# Altium schematic sheet USD_PD.SchDoc
size Letter; SheetNumber: 13; SheetTotal: 15
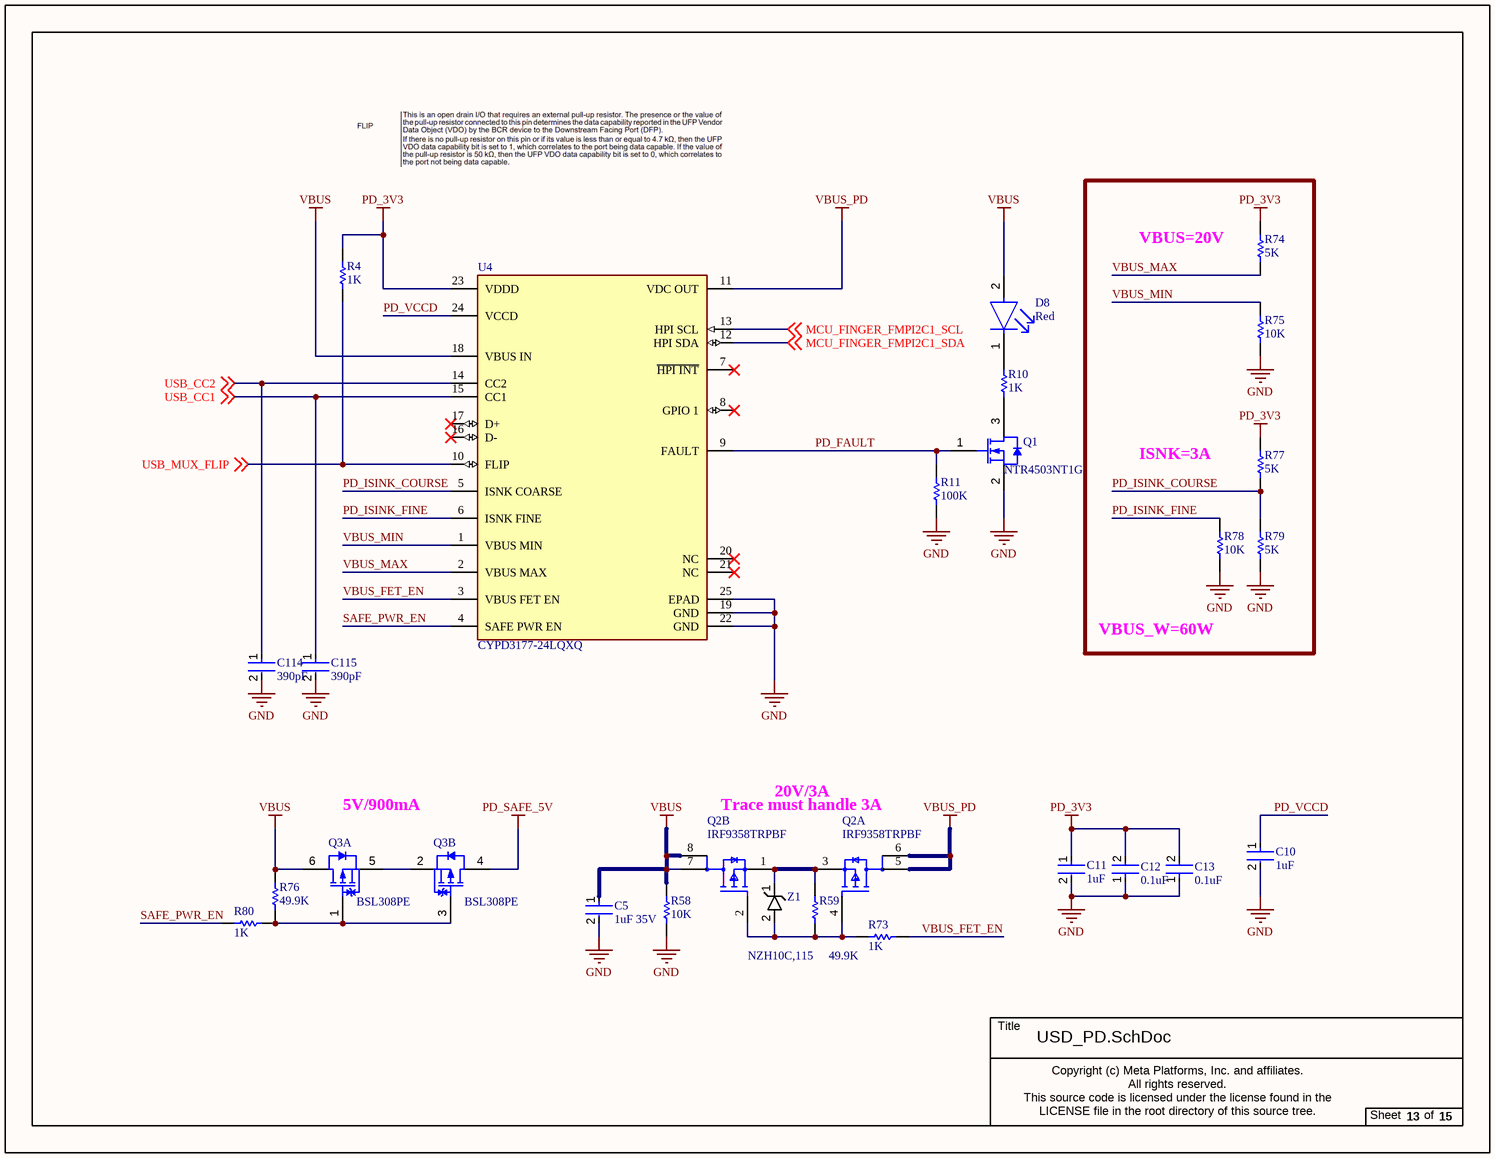
[diagram p0: USD_PD.SchDoc]

## Parts
C5  1uF 35V  [FP-C1005-050-0_05-IPC_C]
C10  1uF  [FP-CL511-IPC_C]
C11  1uF  [FP-CL511-IPC_C]
C12  0.1uF  [FP-CC0201-BA-MFG]
C13  0.1uF  [FP-CC0201-BA-MFG]
C114  390pF  [FP-C0402-BB-MFG]
C115  390pF  [FP-C0402-BB-MFG]
D8  Red  [FP-LTST-C190KRKT-MFG]
Q1  NTR4503NT1G  [ONSC-SOT-23-3-318-08_V]
Q2  IRF9358TRPBF  [FP-PG-DSO-8-IPC_A]  (parts A,B of 2)
Q3  BSL308PE  [INF-PG-TSOP-6_N]  (parts A,B of 2)
R4  1K  [RESC1005X40X25NL05T05]
R10  1K  [RESC1005X40X25NL05T05]
R11  100K  [RESC1005X40X25NL05T10]
R58  10K  [RESC1005X40X25ML05T10]
R59  49.9K  [RESC1005X35X20LL05T10]
R73  1K  [RESC1005X40X25NL05T05]
R74  5K  [RESC1005X35X20LL05T10]
R75  10K  [RESC1005X40X25ML05T10]
R76  49.9K  [RESC1005X35X20LL05T10]
R77  5K  [RESC1005X35X20LL05T10]
R78  10K  [RESC1005X40X25ML05T10]
R79  5K  [RESC1005X35X20LL05T10]
R80  1K  [RESC1005X40X25NL05T05]
U4  CYPD3177-24LQXQ  [FP-002-16934-IPC_C]
Z1  NZH10C,115  [SODFL3516X120N]

## Nets
GND: C5.2 C10.2 C11.2 C12.1 C13.1 C114.2 C115.2 Q1.2(S) R11.1 R58.1 R75.2 R78.2 R79.1 U4.19(GND) U4.22(GND) U4.25(EPAD)
PD_3V3: C11.1 C12.2 C13.2 R4.1 R74.2 R77.2 U4.23(VDDD)
PD_SAFE_5V: Q3.4(DRAIN)
VBUS: C5.1 D8.2(A) Q2.7(D2) Q2.8(D2) Q3.6(DRAIN) R58.2 R76.2 U4.18(VBUS_IN)
VBUS_PD: Q2.5(D1) Q2.6(D1) U4.11(VDC_OUT)
MCU_FINGER_FMPI2C1_SCL: U4.13(HPI_SCL) ; off-sheet MCU_FINGER_FMPI2C1_SCL
MCU_FINGER_FMPI2C1_SDA: U4.12(HPI_SDA) ; off-sheet MCU_FINGER_FMPI2C1_SDA
PD_FAULT: Q1.1(G) R11.2 U4.9(FAULT)
PD_ISINK_COURSE: R77.1 R79.2 U4.5(ISNK_COARSE)
PD_ISINK_FINE: R78.1 U4.6(ISNK_FINE)
PD_VCCD: C10.1 U4.24(VCCD)
SAFE_PWR_EN: R80.2 U4.4(SAFE_PWR_EN)
USB_CC1: C115.1 U4.15(CC1) ; off-sheet USB_CC1
USB_CC2: C114.1 U4.14(CC2) ; off-sheet USB_CC2
USB_MUX_FLIP: R4.2 U4.10(FLIP) ; off-sheet USB_MUX_FLIP
VBUS_FET_EN: R73.1 U4.3(VBUS_FET_EN)
VBUS_MAX: R74.1 U4.2(VBUS_MAX)
VBUS_MIN: R75.1 U4.1(VBUS_MIN)
NetD8_1: D8.1(C) R10.2
NetQ1_3: Q1.3(D) R10.1
NetQ2_1: Q2.1(S2) Q2.3(S1) R59.2 Z1.1(K)
NetQ2_2: Q2.2(G2) Q2.4(G1) R59.1 R73.2 Z1.2(A)
NetQ3_1: Q3.1(GATE) Q3.3(GATE) R76.1 R80.1
NetQ3_2: Q3.2(SOURCE) Q3.5(SOURCE)

Not connected (* = marked no-connect by the designer): U4 7(~{HPI_INT})* 8(GPIO_1)* 16(D-)* 17(D+)* 20(NC)* 21(NC)*

## Notes on the sheet
- (near R74) VBUS=20V
- ISNK=3A
- VBUS_W=60W
- 5V/900mA
- (near Q2) Trace must handle 3A
- 20V/3A
- Title
- Copyright (c) Meta Platforms, Inc. and affiliates.
  All rights reserved.
  This source code is licensed under the license found in the
  LICENSE file in the root directory of this source tree.
- Sheet
- of

## Library data of the parts
C5 = CMP-2000-06004-2: Multilayer Ceramic Capacitors 1μF ±10% 35V X5R SMD 0402; Series: C; Voltage Rating (DC): 35V; Capacitance: 1uF; Max Operating Temperature: 85°C; Resistor Type: Ceramic; REACH SVHC: No SVHC; Package Quantity: 1; Packaging: Tape and Reel; Termination: SMD/SMT; Dielectric Material: Ceramic; Height: 0.5mm; Length: 1mm; Min Operating Temperature: -55°C; Dielectric: X5R; Thickness: 0.022inch; Lead Free: Lead Free; Voltage Rating: 35V; Width: 0.02inch; Depth: 0.5mm; Case Code (Imperial): 0402; Case/Package: 0402; Tolerance: 10%; Weight: 2.3E-05oz; Radiation Hardening: No; RoHS Compliant: Yes; Case Code (Metric): 1005; Mount: Surface Mount
C10 C11 = CMP-13271-001936-1: Cap Ceramic 1uF 10V X5R ±10% SMD 0402 +85°C Paper T/R; Depth: 0.5mm; Case Code (Imperial): 0402; Material: Ceramic; Mount: Surface Mount; Thickness: 0.022inch; Dielectric: X5R; Capacitance: 1uF; Radiation Hardening: No; Case/Package: 0402; Length: 1mm; Tolerance: 10%; Max Operating Temperature: 85°C; Package Quantity: 1; Width: 0.02inch; Voltage Rating: 10V; Contact Plating: Tin; Height: 0.5mm; Min Operating Temperature: -55°C; Case Code (Metric): 1005; Packaging: Tape and Reel
C12 C13 = CMP-03422-000376-1: CAP CER 0.1UF 6.3V X5R 0201; Manufacturer: Yageo; Manufacturer Part Number: CC0201KRX5R5BB104; Tolerance: 0.1; Temperature Coefficient: 15%; Value: 100 nF; Material: Ceramic; Automotive: No; Device Class L2: Capacitors; Temperature Range High: +85°C; Capacitance: 100 nF; Temperature: -55°C to +85°C; ComponentLink2URL: http://www.yageo.com/documents/recent/UPY-GPHC_X5R_4V-to-50V_25.pdf; Category: Cap; Mouser Description: Multilayer Ceramic Capacitors MLCC - SMD/SMT 100nF 6.3V X5R 10%; Ipc Land Pattern Name: CAPC6030X30; Temperature Characteristic: X5R; Voltage Rating: 6.3 V; Lead Free: Yes; Digikey Description: CAP CER 0.1UF 6.3V X5R 0201; Device Class L1: Passive Components; Octopart: https://octopart.com/cc0201krx5r5bb104-yageo-9292636; Height: 0.33mm; Package: CC0201-BA; Footprint Url: http://www.yageo.com/exep/pages/download/literatures/UPY-C_GEN_24.pdf; ComponentLink2Description: Datasheet; Device Class L3: Ceramic Capacitors; Temperature Range Low: -55°C; RoHS: TRUE
C114 C115 = CMP-2008-03313-2: CAP CER 390PF 50V C0G/NP0 0402; Manufacturer Part Number: C0402C391J5GACTU; Manufacturer: Kemet; Tolerance: 0.05; Temperature Coefficient: 15%; Material: Ceramic; Temperature Characteristic: C0G; Device Class L2: Capacitors; Value: 390 pF; Capacitance: 390 pF; Octopart: https://octopart.com/c0402c391j5gactu-kemet-13148117; ComponentLink2URL: https://content.kemet.com/datasheets/KEM_C1002_X7R_SMD.pdf; RoHS: TRUE; Temperature Range High: +125°C; ComponentLink2Description: Datasheet; Voltage Rating: 50 V; Ipc Land Pattern Name: CAPC10050X50; Package: C0402-BB; Lead Free: Yes; Digikey Description: CAP CER 390PF 50V C0G/NP0 0402; Category: Cap; Temperature: -55°C to +125°C; Device Class L3: Ceramic Capacitors; Device Class L1: Passive Components; Temperature Range Low: -55°C; Height: 0.55mm; Mouser Description: Multilayer Ceramic Capacitors MLCC - SMD/SMT 50volts 390pF 5% C0G; Automotive: No
D8 = CMP-1674-00011-2: LED RED CLEAR CHIP SMD; Reverse Voltage: 5V; Viewing Angle: 130°; Power Rating: 75mW; Test Current: 20mA; Number of Elements: 1; Lens Color: Colorless; Wavelength: 639nm; Dominant Wavelength: 631nm; Lens Style: Diffused; Forward Current: 30mA; Forward Voltage: 2.4V; Luminous Intensity: 54mcd; Color: Red; Case Code (Imperial): 0603; Lens Transparency: Clear; Lead Free: Lead Free; Package Quantity: 1; Packaging: Tape and Reel; Max Operating Temperature: 85°C; Number of Pins: 2; Height: 0.8mm; Case/Package: 0603; Number of LEDs: 1; Width: 0.8mm; Case Code (Metric): 1608; Depth: 0.8mm; Mount: Surface Mount; Radiation Hardening: No; Length: 1.6mm; Illumination Color: Red; Power Dissipation: 75mW; Min Operating Temperature: -55°C
Q1 = CMP-1058-00742-1: Power MOSFET, 30 V, 2.5 A, Single N-Channel, 3-Pin SOT-23, Pb-Free, Tape and Reel; Manufacturer: On Semiconductor; Qrr Typ (nC): 4; ID Max (A): 2.5; VGS(th) Max (V): 3; VGS Max (V): 20; Channel Polarity: N Channel; V(BR)DSS Min (V): 30; ComponentLink3URL: http://www.onsemi.cn/pub_link/Collateral/318-08.PDF; PackageReference: SOT-23-3-318-08; ComponentLink2URL: http://www.onsemi.cn/pub_link/Collateral/NTR4503N-D.PDF; ComponentLink2Description: Datasheet; ComponentLink1Description: Manufacturer URL; Configuration: Single; ComponentLink1URL: http://www.onsemi.com/; PackageVersion: Rev. AP, 11/2009; Package Type: SOT-23-3; DatasheetVersion: Rev. 6; ComponentLink3Description: Package Specification; PartNumber: NTR4503NT1G; Packing: Tape and Reel; RoHS: Pb-Free; Mounting Technology: Surface Mount; PackageDescription: 3-Pin Small Outline Transistor, Body 2.92 x 1.3 mm, Pitch 0.95 mm
Q2 = CMP-32901-000912-1: MOSFET 2P-CH 30V 9.2A 8SOIC; Max Dual Supply Voltage: -30V; Max Power Dissipation: 2W; Rds On Max: 16.3mR; Threshold Voltage: -1.8V; Input Capacitance: 1.74nF; Packaging: Cut Tape; Min Operating Temperature: -55°C; Series: HEXFET®; Mount: Surface Mount; Max Operating Temperature: 150°C; Lead Free: Lead Free; Halogen Free: Halogen Free; Continuous Drain Current (ID): 9.2A; Drain to Source Voltage (Vdss): -30V; Case/Package: SO; Number of Pins: 8; RoHS Compliant: Yes
Q3 = CMP-1099-00070-1: P-Channel OptiMOS P3 Small-Signal-Transistor, -30 V VDS, -2 A ID, -55 to 150 degC, PG-TSOP-6, Reel, Green; Manufacturer: Infineon; VGS(th) (max): -1Â V; RDS (on) (max) (@4.5V): 130Â mOhm; QG: -5Â nC; VGS(th) (min): -2Â V; VDS (max): -30Â V; Green: TRUE; ID (max): -2Â A; IDpuls (max): -8Â A; Pto t (max): 0.5Â W; Rth: 250Â K/W; RDS (on) (max): 80Â mOhm; DatasheetVersion: Rev. 2.02; ComponentLink3Description: Package Specification; Packing: Reel; Mounting Technology: Surface Mount; ComponentLink1URL: http://www.infineon.com/; ComponentLink1Description: Manufacturer URL; ComponentLink2Description: Datasheet; ComponentLink2URL: http://www.infineon.com/dgdl/BSL308PE_Rev22.pdf?folderId=db3a304314dca38901154a72e3951a65&fileId=db3a30431d8a6b3c011d8ff3592c03d0; PackageReference: PG-TSOP-6; ComponentLink3URL: http://www.infineon.com/cms/packages/SMD_-_Surface_Mounted_Devices/TSOP/TSOP6.html?__locale=en; PackageDescription: 6-Pin Thin Small Outline Package, 2.9 x 1.6 mm Body, 0.95 mm Pitch; PartNumber: BSL308PE
R4 R10 R73 R80 = CMP-1011-00510-4: Chip Resistor, 1 KOhm, +/- 1%, 100 mW, -55 to 155 degC, 0402 (1005 Metric), RoHS, Tape and Reel; PartNumber: ERJ-2RKF1001X; Manufacturer: Basic Passives; Voltage Rating: 50 V; Case\/Package: 0402; Resistance: 1 KOhm; Power Rating: 100 mW; DatasheetVersion: 04/2015; Radiation Hardening: No; Pins: 2; Height: 0.35 mm; RoHSCompliant: true; Case Code (Imperial): 0402; ComponentLink2Description: Datasheet; ComponentLink1Description: Manufacturer URL; PackageReference: 0402; Mount: Surface Mount; Package Quantity: 10000; Tolerance: 1%; ComponentLink1URL: http://www.panasonic.com/; PackageDescription: 2-Pin Surface Mount Device, Body 1 x 0.5 mm; Mounting Technology: Surface Mount; Case Code (Metric): 1005; ComponentLink2URL: http://industrial.panasonic.com/cdbs/www-data/pdf/RDA0000/AOA0000C86.pdf; REACH SVHC: Yes; Packaging: Tape and Reel; Max Operating Temperature: 155 degC; Min Operating Temperature: -55 degC; Width: 0.5 mm; Length: 1 mm
R11 = CMP-2002-07343-1: Part Number: RC0402FR-07100KL; Manufacturer: Yageo / Phycomp
R58 R75 R78 = CMP-2002-03043-1: Part Number: CRCW040210K0FKEDHP; Manufacturer: Vishay Dale
R59 R76 = CMP-2002-03315-1: Part Number: CPF0402B49K9E1; Manufacturer: TE Connectivity / AMP
R74 R77 R79 = CMP-2002-03342-1: Manufacturer: TE Connectivity / AMP; Part Number: CPF0402B5K1E1
U4 = CMP-12917-000005-1: IC USB TYPE-C PORT CONTROL 24QFN
Z1 = NZH10C,115: Zener Diode; Manufacturer_Name: Nexperia; Datasheet Link: https://assets.nexperia.com/documents/data-sheet/NZH_SER.pdf; Height: 1.2mm; Manufacturer_Part_Number: NZH10C,115; Mouser Part Number: 771-NZH10C-115; Mouser Price/Stock: https://www.mouser.co.uk/ProductDetail/Nexperia/NZH10C115?qs=5DYmZrWuUEoyHVRX7wWPEg%3D%3D; Arrow Part Number: NZH10C,115; Arrow Price/Stock: https://www.arrow.com/en/products/nzh10c115/nexperia?region=nac